# Altium project deepshark.PrjPcb
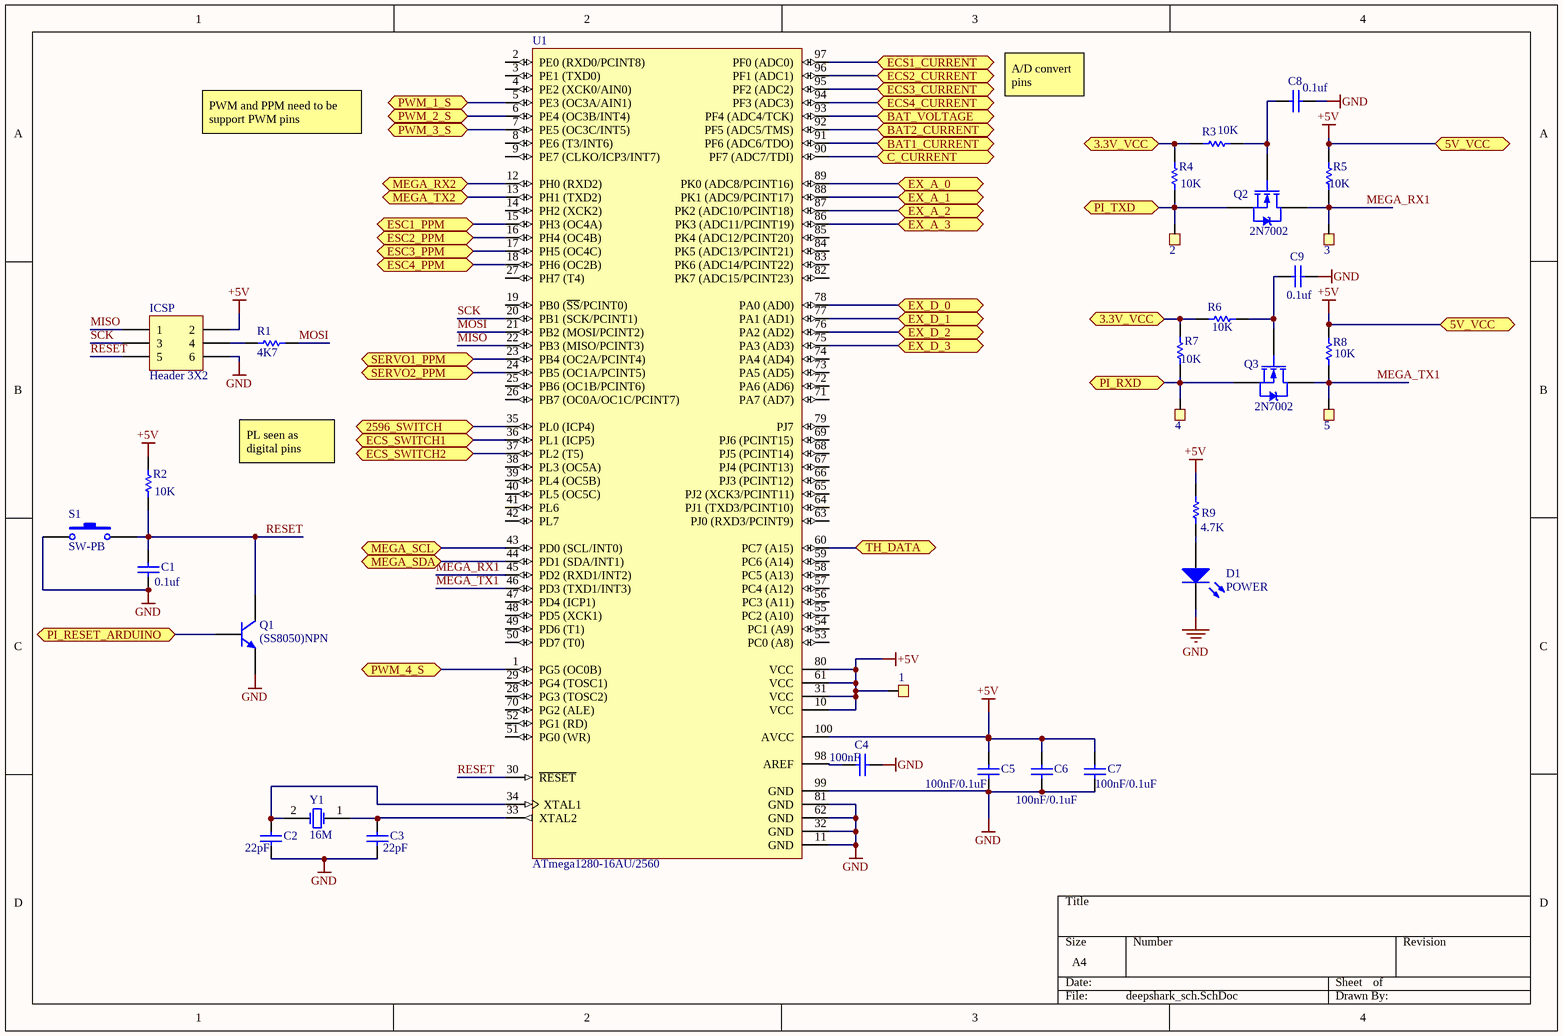
[diagram p0: deepshark_sch.SchDoc]
8 sheets, 211 parts. Net scope: flat (ports and power ports of the same name join across sheets).
Board file: deepshark_pcb.PcbDoc
Sheets:
  deepshark_sch.SchDoc
  deepshark_connector.SchDoc
  deepshark_power_sch.SchDoc
  deepshark_power_switch.SchDoc
  deepshark_pwm_power.SchDoc
  deepshark_sensor.SchDoc
  deepshark_ecs.SchDoc
  deepshark_servo.SchDoc

## Sheet deepshark_sch.SchDoc
size A4

### Parts
1  TP1  [TestPoint]  (value not drawn)
2  TP  [TestPoint]  (value not drawn)
3  TP  [TestPoint]  (value not drawn)
4  TP  [TestPoint]  (value not drawn)
5  TP  [TestPoint]  (value not drawn)
C1  value 0.1uf  [6-0805_M]  (hidden comment: Cap)
C2  value 22pF  [6-0805_M]  (hidden comment: Cap)
C3  value 22pF  [6-0805_M]  (hidden comment: Cap)
C4  value 100nF  [6-0805_M]  (hidden comment: Cap)
C5  value 100nF/0.1uF  [6-0805_M]  (hidden comment: Cap)
C6  value 100nF/0.1uF  [6-0805_M]  (hidden comment: Cap)
C7  value 100nF/0.1uF  [6-0805_M]  (hidden comment: Cap)
C8  value 0.1uf  [6-0805_M]  (hidden comment: Cap)
C9  value 0.1uf  [6-0805_M]  (hidden comment: Cap)
D1  POWER  [6-0805_M]
ICSP  Header 3X2  [HDR2X3]
Q1  (SS8050)NPN  [SOT89M]
Q2  2N7002  [2N7002]
Q3  2N7002  [2N7002]
R1  value 4K7  [6-0805_M]  (hidden comment: Res1)
R2  value 10K  [6-0805_M]  (hidden comment: Res1)
R3  value 10K  [6-0805_M]  (hidden comment: Res1)
R4  value 10K  [6-0805_M]  (hidden comment: Res1)
R5  value 10K  [6-0805_M]  (hidden comment: Res1)
R6  value 10K  [6-0805_M]  (hidden comment: Res1)
R7  value 10K  [6-0805_M]  (hidden comment: Res1)
R8  value 10K  [6-0805_M]  (hidden comment: Res1)
R9  value 4.7K  [6-0805_M]  (hidden comment: Res1)
S1  SW-PB  [switch4]
U1  ATmega1280-16AU/2560  [100A_N]
Y1  16M  [Y]

### Ports
3.3V_VCC, 5V_VCC, 2596_SWITCH, BAT1_CURRENT, BAT2_CURRENT, BAT_VOLTAGE, C_CURRENT, ECS1_CURRENT, ECS2_CURRENT, ECS3_CURRENT, ECS4_CURRENT, ECS_SWITCH1, ECS_SWITCH2, ESC1_PPM, ESC2_PPM, ESC3_PPM, ESC4_PPM, EX_A_0, EX_A_1, EX_A_2, EX_A_3, EX_D_0, EX_D_1, EX_D_2, EX_D_3, MEGA_RX2, MEGA_SCL, MEGA_SDA, MEGA_TX2, PI_RESET_ARDUINO, PI_RXD, PI_TXD, PWM_1_S, PWM_2_S, PWM_3_S, PWM_4_S, SERVO1_PPM, SERVO2_PPM, TH_DATA

### Nets
+5V: 1.1 C5.2 C6.2 C7.2 ICSP.2 R2.2 R5.2 R8.1 R9.1 U1.10(VCC) U1.31(VCC) U1.61(VCC) U1.80(VCC) U1.100(AVCC) ; port 5V_VCC
GND: C1.1 C2.2 C3.2 C4.1 C5.1 C6.1 C7.1 C8.2 C9.2 D1.2(K) ICSP.6 Q1.3(E) S1.1 U1.11(GND) U1.32(GND) U1.62(GND) U1.81(GND) U1.99(GND)
MEGA_RX1: 3.1 Q2.2(D) R5.1 U1.45(PD2_(RXD1/INT2))
MEGA_TX1: 5.1 Q3.2(D) R8.2 U1.46(PD3_(TXD1/INT3))
MISO: ICSP.1 U1.22(PB3_(MISO/PCINT3))
MOSI: R1.2 U1.21(PB2_(MOSI/PCINT2))
R_ONOFF: U1.35(PL0_(ICP4)) ; port 2596_SWITCH
RESET: C1.2 ICSP.5 Q1.1(C) R2.1 S1.2 U1.30(~{RESET})
SCK: ICSP.3 U1.20(PB1_(SCK/PCINT1))
Net2_1: 2.1 Q2.3(S) R4.2 ; port PI_TXD
Net4_1: 4.1 Q3.3(S) R7.1 ; port PI_RXD
Net9_1: R3.2 R4.1 R6.1 R7.2 ; port 3.3V_VCC
Net15_1: U1.93(PF4_(ADC4/TCK)) ; port BAT_VOLTAGE
Net20_1: U1.60(PC7_(A15)) ; port TH_DATA
Net22_1: U1.44(PD1_(SDA/INT1)) ; port MEGA_SDA
Net24_1: U1.43(PD0_(SCL/INT0)) ; port MEGA_SCL
NetC2_1: C2.1 U1.34(XTAL1) Y1.2(OSC2)
NetC3_1: C3.1 U1.33(XTAL2) Y1.1(OSC1)
NetC4_2: C4.2 U1.98(AREF)
NetC8_1: C8.1 Q2.1(G) R3.1
NetC9_1: C9.1 Q3.1(G) R6.2
NetD1_1: D1.1(A) R9.2
Netext_1: U1.89(PK0_(ADC8/PCINT16)) ; port EX_A_0
Netext_2: U1.78(PA0_(AD0)) ; port EX_D_0
Netext_3: U1.88(PK1_(ADC9/PCINT17)) ; port EX_A_1
Netext_4: U1.77(PA1_(AD1)) ; port EX_D_1
Netext_5: U1.87(PK2_(ADC10/PCINT18)) ; port EX_A_2
Netext_6: U1.76(PA2_(AD2)) ; port EX_D_2
Netext_7: U1.86(PK3_(ADC11/PCINT19)) ; port EX_A_3
Netext_8: U1.75(PA3_(AD3)) ; port EX_D_3
NetICSP_4: ICSP.4 R1.1
NetP16_3: U1.15(PH3_(OC4A)) ; port ESC1_PPM
NetP17_3: U1.16(PH4_(OC4B)) ; port ESC2_PPM
NetP18_3: U1.17(PH5_(OC4C)) ; port ESC3_PPM
NetP19_3: U1.18(PH6_(OC2B)) ; port ESC4_PPM
NetP35_1: U1.24(PB5_(OC1A/PCINT5)) ; port SERVO2_PPM
NetP36_1: U1.23(PB4_(OC2A/PCINT4)) ; port SERVO1_PPM
NetPI3_22: Q1.2(B) ; port PI_RESET_ARDUINO
NetR18_2: U1.91(PF6_(ADC6/TDO)) ; port BAT1_CURRENT
NetR22_2: U1.92(PF5_(ADC5/TMS)) ; port BAT2_CURRENT
NetR24_1: U1.36(PL1_(ICP5)) ; port ECS_SWITCH1
NetR26_2: U1.37(PL2_(T5)) ; port ECS_SWITCH2
NetR35_1: U1.90(PF7_(ADC7/TDI)) ; port C_CURRENT
NetR36_1: U1.5(PE3_(OC3A/AIN1)) ; port PWM_1_S
NetR38_1: U1.6(PE4_(OC3B/INT4)) ; port PWM_2_S
NetR40_1: U1.7(PE5_(OC3C/INT5)) ; port PWM_3_S
NetR42_1: U1.1(PG5_(OC0B)) ; port PWM_4_S
NetR55_2: U1.97(PF0_(ADC0)) ; port ECS1_CURRENT
NetR59_2: U1.96(PF1_(ADC1)) ; port ECS2_CURRENT
NetR63_2: U1.95(PF2_(ADC2)) ; port ECS3_CURRENT
NetR67_2: U1.94(PF3_(ADC3)) ; port ECS4_CURRENT
NetRX2_1: U1.13(PH1_(TXD2)) ; port MEGA_TX2
NetRX2_2: U1.12(PH0_(RXD2)) ; port MEGA_RX2

Not connected (* = marked no-connect by the designer): U1 2(PE0_(RXD0/PCINT8)) 3(PE1_(TXD0)) 4(PE2_(XCK0/AIN0)) 8(PE6_(T3/INT6)) 9(PE7_(CLKO/ICP3/INT7)) 14(PH2_(XCK2)) 19(PB0_(~{SS}/PCINT0)) 25(PB6_(OC1B/PCINT6)) 26(PB7_(OC0A/OC1C/PCINT7)) 27(PH7_(T4)) 28(PG3_(TOSC2)) 29(PG4_(TOSC1)) 38(PL3_(OC5A)) 39(PL4_(OC5B)) 40(PL5_(OC5C)) 41(PL6) 42(PL7) 47(PD4_(ICP1)) 48(PD5_(XCK1)) 49(PD6_(T1)) 50(PD7_(T0)) 51(PG0_(WR)) 52(PG1_(RD)) 53(PC0_(A8)) 54(PC1_(A9)) 55(PC2_(A10)) 56(PC3_(A11)) 57(PC4_(A12)) 58(PC5_(A13)) 59(PC6_(A14)) 63(PJ0_(RXD3/PCINT9)) 64(PJ1_(TXD3/PCINT10)) 65(PJ2_(XCK3/PCINT11)) 66(PJ3_(PCINT12)) 67(PJ4_(PCINT13)) 68(PJ5_(PCINT14)) 69(PJ6_(PCINT15)) 70(PG2_(ALE)) 71(PA7_(AD7)) 72(PA6_(AD6)) 73(PA5_(AD5)) 74(PA4_(AD4)) 79(PJ7) 82(PK7_(ADC15/PCINT23)) 83(PK6_(ADC14/PCINT22)) 84(PK5_(ADC13/PCINT21)) 85(PK4_(ADC12/PCINT20))

### Notes on the sheet
- A/D convert pins
- PWM and PPM need to be support PWM pins
- PL seen as digital pins

### Library data of the parts
1 = TP
C1-C9 = Cap: Capacitor; Published: 8-Jun-2000; LatestRevisionDate: 17-Jul-2002; LatestRevisionNote: Re-released for DXP Platform.; PackageReference: RAD-0.3; Publisher: Altium Limited; PackageDescription: Radial Cap, Thru-Hole; 2 Leads; 0.3 in Pin Spacing
D1 = LED0: Typical INFRARED GaAs LED; Published: 8-Jun-2000; LatestRevisionDate: 08-Jul-2005; LatestRevisionNote: Mech Layer 1 removed.; PackageReference: LED-0; Publisher: Altium Limited; PackageDescription: LED; 2 Leads
ICSP = Header 3X2: Header, 3-Pin, Dual row; LatestRevisionDate: 17-Jul-2002; LatestRevisionNote: Re-released for DXP Platform.; Publisher: Altium Limited
Q1 = NPN: NPN Bipolar Transistor; pin to pad: 1>2 2>1; Published: 8-Jun-2000; LatestRevisionDate: 17-Jul-2002; LatestRevisionNote: Re-released for DXP Platform.; PackageReference: TO-226-AA; Publisher: Altium Limited; PackageDescription: TO, Flat Index; 3 In-Line, Axial Leads; Body Dia. 4.8mm; Leads 0.55 x 0.51 mm (max); Code_JEDEC: TO-226-AA
Q2 Q3 = NMOS-2: N-Channel Power MOSFET; Note: Pin 2 is electrically connected to pin 4.; Published: 8-Jun-2000; LatestRevisionDate: 17-Jul-2002; LatestRevisionNote: Re-released for DXP Platform.; DatasheetVersion: PD-9.814; PackageVersion: Feb-1997; PackageReference: TO-220AB; Publisher: Altium Limited; PackageDescription: TO, Thru-Hole, Vertical, Heatsink Mounted; 3 In-Line Leads; Pitch 2.54 mm; ComponentLink1Description: Manufacturer Link; ComponentLink1URL: http://www.irf.com/
R1-R9 = Res1: Resistor; Published: 8-Jun-2000; LatestRevisionDate: 17-Jul-2002; LatestRevisionNote: Re-released for DXP Platform.; PackageReference: AXIAL-0.3; Publisher: Altium Limited; PackageDescription: Axial Device, Thru-Hole; 2 Leads; 0.3 in Pin Spacing
S1 = SW-PB: Switch; Published: 24-Mar-1999; LatestRevisionDate: 17-Jul-2002; LatestRevisionNote: Re-released for DXP Platform.; PackageReference: SPST-2; Publisher: Altium Limited; PackageDescription: Switch; 2 Leads
U1 = ATmega1280-16AU: 8-bit AVR Microcontroller, 2.7-5.5V, 8MHz, 128KB Flash, 4KB EEPROM, 8KB SRAM, 86 GPIO pins, 100-pin TQFP, Industrial Grade (-40癈 to 85癈), Pb-Free; DatasheetVersion: revN, May-2011; PackageVersion: revD, Oct-2010; PackageReference: 100A; PackageDescription: 100-Pin Thin Profile Plastic Quad Flat Pack (TQFP), 14 x 14 x 1.0 mm Body, 0.5 mm Pitch; Code_JEDEC: MS-026-AED; ComponentLink1Description: Manufacturer URL; ComponentLink1URL: http://www.atmel.com/; ComponentLink2Description: ATmega640/1280/1281/2560/2561 Datasheet; ComponentLink2URL: http://www.atmel.com/dyn/resources/prod_documents/doc2549.pdf; ComponentLink3Description: ATmega640/1280/1281/2560/2561 Summary; ComponentLink3URL: http://www.atmel.com/dyn/resources/prod_documents/2549S.pdf
Y1 = XTAL: Crystal Oscillator; Published: 8-Jun-2000; LatestRevisionDate: 17-Jul-2002; LatestRevisionNote: Re-released for DXP Platform.; PackageReference: R38; Publisher: Altium Limited; PackageDescription: Crystal, Thru-Hole; 2 Leads; Body 3.1 x 8.2 mm (Dia.xH)

## Sheet deepshark_connector.SchDoc
size A4
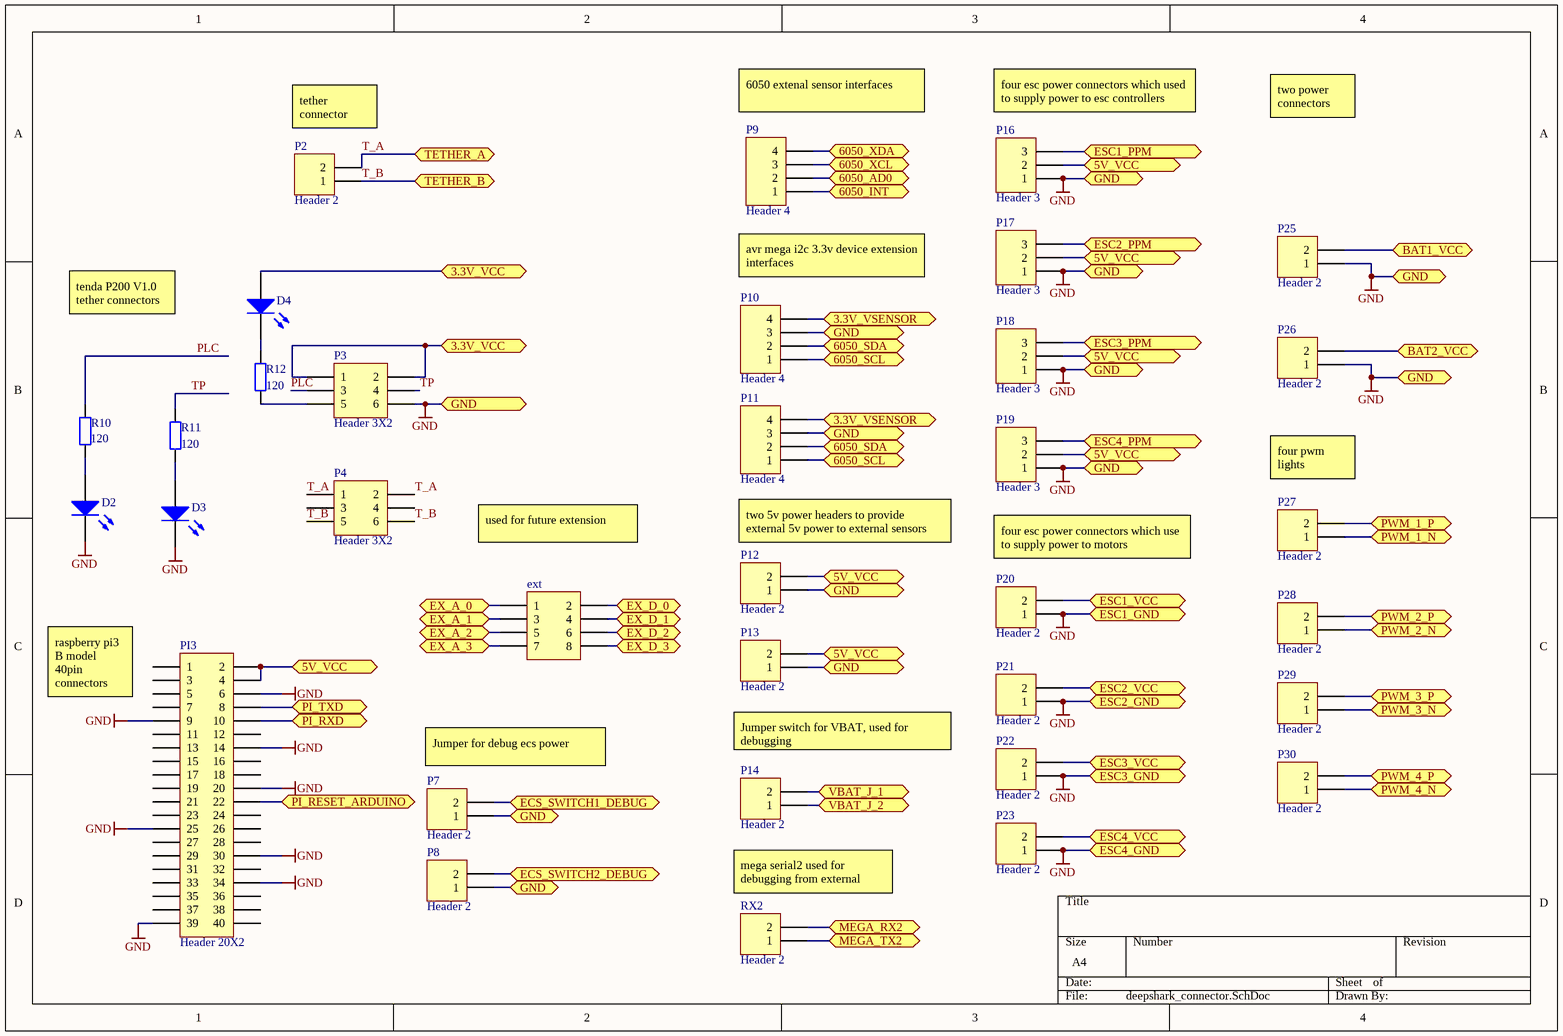
[diagram p1: deepshark_connector.SchDoc]

### Parts
D2  LED0  [6-0805_M]  (value not drawn)
D3  LED0  [6-0805_M]  (value not drawn)
D4  LED0  [6-0805_M]  (value not drawn)
ext  *  [HDR2X4]  (value not drawn)
P2  Header 2  [ConnectorBlue]
P3  Header 3X2  [HDR2X3]
P4  Header 3X2  [HDR2X3]
P7  Header 2  [HDR1X2]
P8  Header 2  [HDR1X2]
P9  Header 4  [HDR1X4]
P10  Header 4  [HDR1X4]
P11  Header 4  [HDR1X4]
P12  Header 2  [HDR1X2]
P13  Header 2  [HDR1X2]
P14  Header 2  [HDR1X2]
P16  Header 3  [HDR1X3]
P17  Header 3  [HDR1X3]
P18  Header 3  [HDR1X3]
P19  Header 3  [HDR1X3]
P20  Header 2  [ConnectorBlue]
P21  Header 2  [ConnectorBlue]
P22  Header 2  [ConnectorBlue]
P23  Header 2  [ConnectorBlue]
P25  Header 2  [ConnectorBlue]
P26  Header 2  [ConnectorBlue]
P27  Header 2  [headerX2]
P28  Header 2  [headerX2]
P29  Header 2  [headerX2]
P30  Header 2  [headerX2]
PI3  Header 20X2  [HDR2X20]
R10  value 120  [6-0805_M]  (hidden comment: Res2)
R11  value 120  [6-0805_M]  (hidden comment: Res2)
R12  value 120  [6-0805_M]  (hidden comment: Res2)
RX2  Header 2  [HDR1X2]

### Ports
3.3V_VCC, 3.3V_VSENSOR, 5V_VCC, 6050_AD0, 6050_INT, 6050_SCL, 6050_SDA, 6050_XCL, 6050_XDA, BAT1_VCC, BAT2_VCC, ECS_SWITCH1_DEBUG, ECS_SWITCH2_DEBUG, ESC1_GND, ESC1_PPM, ESC1_VCC, ESC2_GND, ESC2_PPM, ESC2_VCC, ESC3_GND, ESC3_PPM, ESC3_VCC, ESC4_GND, ESC4_PPM, ESC4_VCC, EX_A_0, EX_A_1, EX_A_2, EX_A_3, EX_D_0, EX_D_1, EX_D_2, EX_D_3, GND, MEGA_RX2, MEGA_TX2, PI_RESET_ARDUINO, PI_RXD, PI_TXD, PWM_1_N, PWM_1_P, PWM_2_N, PWM_2_P, PWM_3_N, PWM_3_P, PWM_4_N, PWM_4_P, TETHER_A (bidir), TETHER_B (bidir), VBAT_J_1, VBAT_J_2

### Nets
+5V: P12.2 P13.2 P16.2 P17.2 P18.2 P19.2 PI3.2 PI3.4 ; port 5V_VCC
BAT1: P25.2 ; port BAT1_VCC
BAT2: P26.2 ; port BAT2_VCC
GND: D2.2(K) D3.2(K) P3.6 P7.1 P8.1 P10.3 P11.3 P12.1 P13.1 P14.1 P16.1 P17.1 P18.1 P19.1 P20.1 P21.1 P22.1 P23.1 P25.1 P26.1 PI3.6 PI3.9 PI3.14 PI3.20 PI3.25 PI3.30 PI3.34 PI3.39 ; port GND, port ESC1_GND, port ESC2_GND, port ESC3_GND, port ESC4_GND, port VBAT_J_2
PLC: P3.3 R10.2
T_A: P2.2 P4.1 P4.2 ; port TETHER_A
T_B: P2.1 P4.5 P4.6 ; port TETHER_B
TP: P3.4 R11.2
Net2_1: PI3.8 ; port PI_TXD
Net4_1: PI3.10 ; port PI_RXD
Net9_1: D4.1(A) P3.1 P3.2 ; port 3.3V_VCC
Net10_1: P10.4 P11.4 ; port 3.3V_VSENSOR
Net13_1: P7.2 ; port ECS_SWITCH1_DEBUG
Net14_1: P8.2 ; port ECS_SWITCH2_DEBUG
Net16_1: P27.1 ; port PWM_1_N
Net17_1: P29.1 ; port PWM_3_N
Net18_1: P28.1 ; port PWM_2_N
Net19_1: P30.1 ; port PWM_4_N
Net21_1: P10.2 P11.2 ; port 6050_SDA
Net23_1: P10.1 P11.1 ; port 6050_SCL
Net25_1: P20.2 ; port ESC1_VCC
Net26_1: P21.2 ; port ESC2_VCC
Net27_1: P22.2 ; port ESC3_VCC
Net28_1: P23.2 ; port ESC4_VCC
NetC20_1: P27.2 P28.2 P29.2 P30.2 ; port PWM_1_P, port PWM_2_P, port PWM_3_P, port PWM_4_P
NetD2_1: D2.1(A) R10.1
NetD3_1: D3.1(A) R11.1
NetD4_2: D4.2(K) R12.2
Netext_1: ext.1 ; port EX_A_0
Netext_2: ext.2 ; port EX_D_0
Netext_3: ext.3 ; port EX_A_1
Netext_4: ext.4 ; port EX_D_1
Netext_5: ext.5 ; port EX_A_2
Netext_6: ext.6 ; port EX_D_2
Netext_7: ext.7 ; port EX_A_3
Netext_8: ext.8 ; port EX_D_3
NetP3_5: P3.5 R12.1
NetP9_1: P9.1 ; port 6050_INT
NetP9_2: P9.2 ; port 6050_AD0
NetP9_3: P9.3 ; port 6050_XCL
NetP9_4: P9.4 ; port 6050_XDA
NetP14_2: P14.2 ; port VBAT_J_1
NetP16_3: P16.3 ; port ESC1_PPM
NetP17_3: P17.3 ; port ESC2_PPM
NetP18_3: P18.3 ; port ESC3_PPM
NetP19_3: P19.3 ; port ESC4_PPM
NetPI3_22: PI3.22 ; port PI_RESET_ARDUINO
NetRX2_1: RX2.1 ; port MEGA_TX2
NetRX2_2: RX2.2 ; port MEGA_RX2

Not connected (* = marked no-connect by the designer): P4 3 4; PI3 1 3 5 7 11 12 13 15 16 17 18 19 21 23 24 26 27 28 29 31 32 33 35 36 37 38 40

### Notes on the sheet
- (near P9) 6050 extenal sensor interfaces
- (near P16) four esc power connectors which used to supply power to esc controllers
- two power connectors
- (near P2) tether connector
- tenda P200 V1.0 tether connectors
- avr mega i2c 3.3v device extension interfaces
- (near P27) four pwm lights connectors
- used for future extension
- two 5v power headers to provide external 5v power to external sensors
- four esc power connectors which use to supply power to motors
- (near PI3) raspberry pi3 B model 40pin connectors
- (near P7) Jumper for debug ecs power
- Jumper switch for VBAT, used for debugging
- mega serial2 used for debugging from external

### Library data of the parts
D2-D4 = LED0: Typical INFRARED GaAs LED; Published: 8-Jun-2000; LatestRevisionDate: 08-Jul-2005; LatestRevisionNote: Mech Layer 1 removed.; PackageReference: LED-0; Publisher: Altium Limited; PackageDescription: LED; 2 Leads
ext = Header 4X2: Header, 4-Pin, Dual row; LatestRevisionDate: 17-Jul-2002; LatestRevisionNote: Re-released for DXP Platform.; Publisher: Altium Limited
P2 P7 P8 P12-P14 P20-P23 P25-P30 RX2 = Header 2: Header, 2-Pin; LatestRevisionDate: 17-Jul-2002; LatestRevisionNote: Re-released for DXP Platform.; Publisher: Altium Limited
P3 P4 = Header 3X2: Header, 3-Pin, Dual row; LatestRevisionDate: 17-Jul-2002; LatestRevisionNote: Re-released for DXP Platform.; Publisher: Altium Limited
P9-P11 = Header 4: Header, 4-Pin; LatestRevisionDate: 17-Jul-2002; LatestRevisionNote: Re-released for DXP Platform.; Publisher: Altium Limited
P16-P19 = Header 3: Header, 3-Pin; LatestRevisionDate: 17-Jul-2002; LatestRevisionNote: Re-released for DXP Platform.; Publisher: Altium Limited
PI3 = Header 20X2: Header, 20-Pin, Dual row; LatestRevisionDate: 17-Jul-2002; LatestRevisionNote: Re-released for DXP Platform.; Publisher: Altium Limited
R10-R12 = Res2: Resistor; Published: 8-Jun-2000; LatestRevisionDate: 17-Jul-2002; LatestRevisionNote: Re-released for DXP Platform.; PackageReference: AXIAL-0.4; Publisher: Altium Limited; PackageDescription: Axial Device, Thru-Hole; 2 Leads; 0.4 in Pin Spacing

## Sheet deepshark_power_sch.SchDoc
size A4
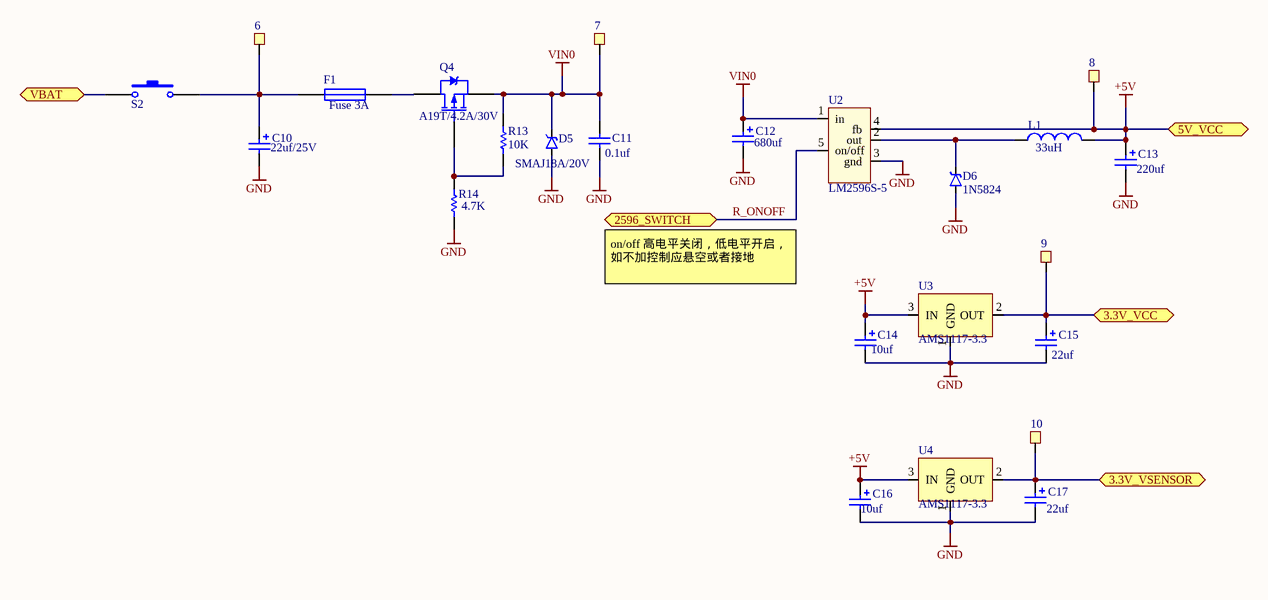
[diagram p2: deepshark_power_sch.SchDoc]

### Parts
6  TP  [TestPoint]  (value not drawn)
7  TP  [TestPoint]  (value not drawn)
8  TP  [TestPoint]  (value not drawn)
9  TP  [TestPoint]  (value not drawn)
10  TP  [TestPoint]  (value not drawn)
C10  value 22uf/25V  [22uf-25V]  (hidden comment: Cap Pol2)
C11  value 0.1uf  [6-0805_M]  (hidden comment: Cap)
C12  value 680uf  [680uf-50v]  (hidden comment: Cap Pol2)
C13  value 220uf  [220uf-50v]  (hidden comment: Cap Pol2)
C14  value 10uf  [1206]  (hidden comment: Cap Pol2)
C15  value 22uf  [my0603]  (hidden comment: Cap Pol2)
C16  value 10uf  [1206]  (hidden comment: Cap Pol2)
C17  value 22uf  [my0603]  (hidden comment: Cap Pol2)
D5  SMAJ18A/20V  [SMBJ6.5A]
D6  1N5824  [1N5824]
F1  Fuse 3A  [1206]
L1  value 33uH  [12x12 L]  (hidden comment: Inductor)
Q4  A19T/4.2A/30V  [A19T]
R13  value 10K  [6-0805_M]  (hidden comment: Res1)
R14  value 4.7K  [6-0805_M]  (hidden comment: Res1)
S2  SW-PB  [switch-2bit]  (value not drawn)
U2  LM2596S-5  [LM2596]
U3  AMS1117-3.3  [SOT223_M]
U4  AMS1117-3.3  [SOT223_M]

### Ports
3.3V_VCC, 3.3V_VSENSOR, 5V_VCC, 2596_SWITCH, VBAT

### Nets
+5V: 8.1 C13.1 C14.1 C16.1 L1.2 U2.4(fb) U3.3(IN) U4.3(IN) ; port 5V_VCC
GND: C10.2 C11.1 C12.2 C13.2 C14.2 C15.2 C16.2 C17.2 D5.A D6.A R14.1 U2.3(gnd) U3.1(GND) U4.1(GND)
VIN0: 7.1 C11.2 C12.1 D5.K Q4.3(S) R13.1 U2.1(in)
R_ONOFF: U2.5(on/off) ; port 2596_SWITCH
Net6_1: 6.1 C10.1 F1.1 S2.1
Net9_1: 9.1 C15.1 U3.2(OUT) ; port 3.3V_VCC
Net10_1: 10.1 C17.1 U4.2(OUT) ; port 3.3V_VSENSOR
NetD6_K: D6.K L1.1 U2.2(out)
NetF1_2: F1.2 Q4.2(D)
NetQ4_1: Q4.1(G) R13.2 R14.2
NetR32_1: S2.2 ; port VBAT

### Notes on the sheet
- on/off 高电平关闭，低电平开启，如不加控制应悬空或者接地

### Library data of the parts
C10 C12-C17 = Cap Pol2: Polarized Capacitor (Axial); Published: 8-Jun-2000; LatestRevisionDate: 17-Jul-2002; LatestRevisionNote: Re-released for DXP Platform.; PackageReference: POLAR0.8; Publisher: Altium Limited; PackageDescription: Polarized Capacitor; 2 Leads
C11 = Cap: Capacitor; Published: 8-Jun-2000; LatestRevisionDate: 17-Jul-2002; LatestRevisionNote: Re-released for DXP Platform.; PackageReference: RAD-0.3; Publisher: Altium Limited; PackageDescription: Radial Cap, Thru-Hole; 2 Leads; 0.3 in Pin Spacing
D5 D6 = DW
F1 = Fuse 1: Fuse; Published: 8-Jun-2000; LatestRevisionDate: 17-Jul-2002; LatestRevisionNote: Re-released for DXP Platform.; PackageReference: PIN-W2/E2.8; Publisher: Altium Limited; PackageDescription: Thru-Hole; 2 Leads
L1 = Inductor: Code_IEC: 1005; Published: 8-Jun-2000; LatestRevisionDate: 29-May-2009; LatestRevisionNote: IPC-7351 Footprint Added.; PackageReference: 0402-A; Publisher: Altium Limited; PackageDescription: Chip Inductor; Code_JEITA: 0402
Q4 = PMOS-2: P-Channel Power MOSFET; Note: Pin 4 not drawn and electrically connected to Pin 2.; Published: 8-Jun-2000; LatestRevisionDate: 17-Jul-2002; LatestRevisionNote: Re-released for DXP Platform.; DatasheetVersion: PD-9.390D; PackageVersion: Feb-1997; PackageReference: TO-220AB; Publisher: Altium Limited; PackageDescription: TO, Thru-Hole, Vertical, Heatsink Mounted; 3 In-Line Leads; Pitch 2.54 mm; ComponentLink1Description: Manufacturer Link; ComponentLink1URL: http://www.irf.com/
R13 R14 = Res1: Resistor; Published: 8-Jun-2000; LatestRevisionDate: 17-Jul-2002; LatestRevisionNote: Re-released for DXP Platform.; PackageReference: AXIAL-0.3; Publisher: Altium Limited; PackageDescription: Axial Device, Thru-Hole; 2 Leads; 0.3 in Pin Spacing
S2 = SW-PB: Switch; Published: 24-Mar-1999; LatestRevisionDate: 17-Jul-2002; LatestRevisionNote: Re-released for DXP Platform.; PackageReference: SPST-2; Publisher: Altium Limited; PackageDescription: Switch; 2 Leads

## Sheet deepshark_power_switch.SchDoc
size A4
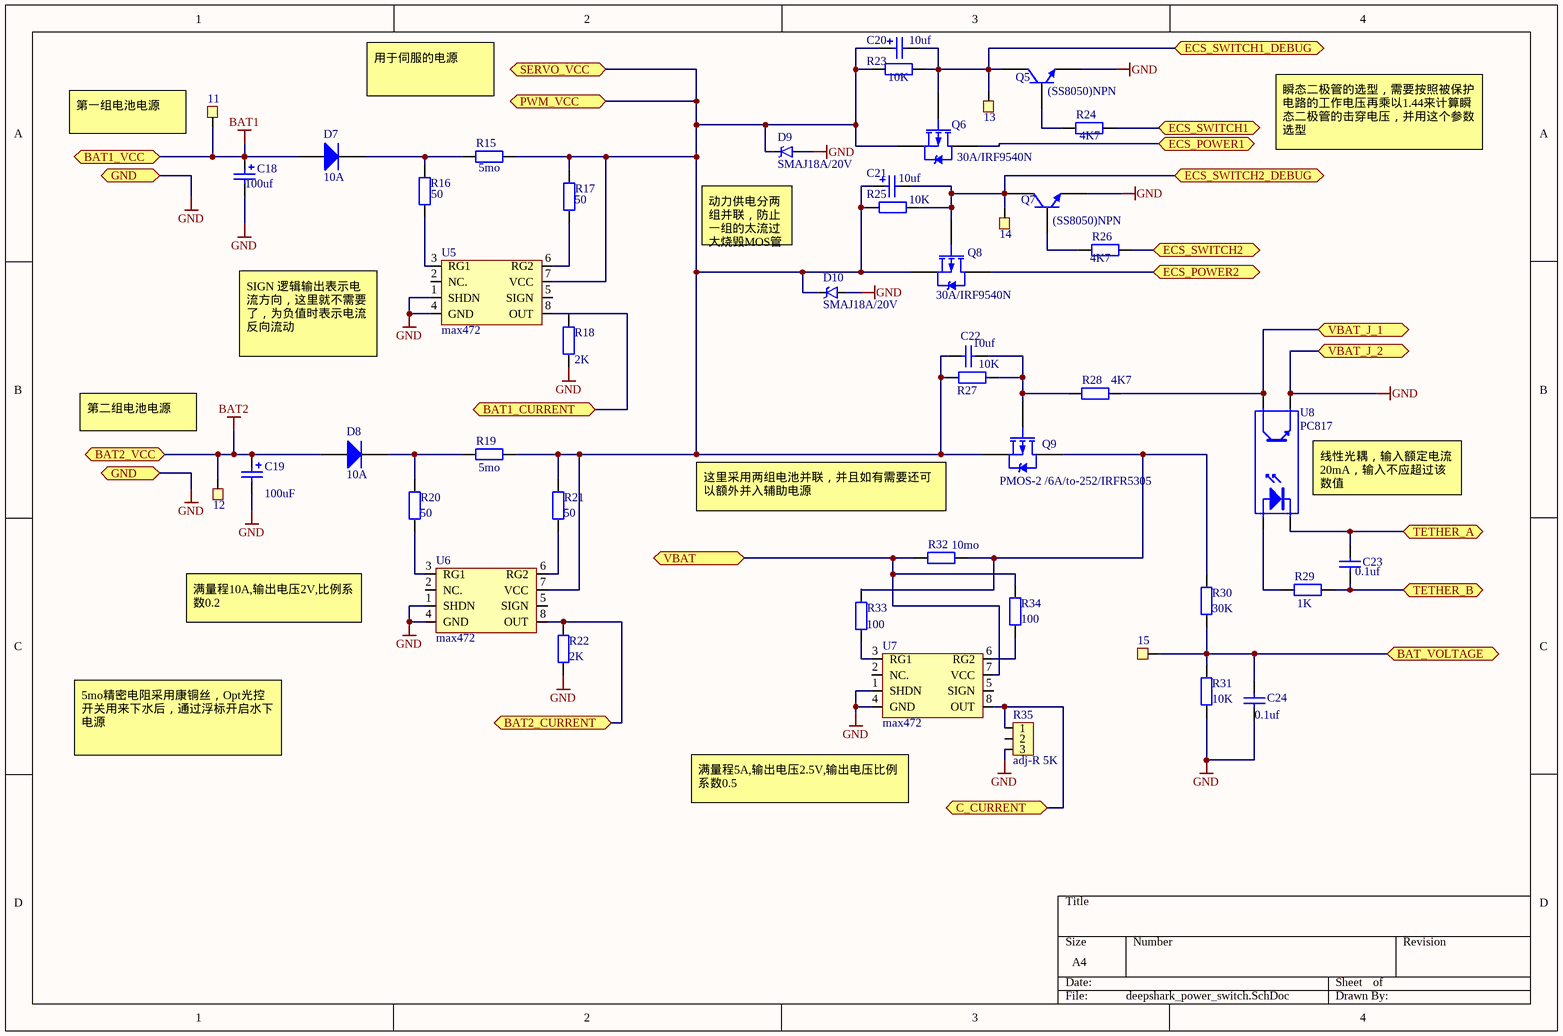
[diagram p3: deepshark_power_switch.SchDoc]

### Parts
11  TP  [TestPoint]  (value not drawn)
12  TP  [TestPoint]  (value not drawn)
13  TP  [TestPoint]  (value not drawn)
14  TP  [TestPoint]  (value not drawn)
15  TP  [TestPoint]  (value not drawn)
C18  value 100uf  [100uf-25v]  (hidden comment: Cap Pol2)
C19  value 100uF  [100uf-25v]  (hidden comment: Cap Pol2)
C20  value 10uf  [1206]  (hidden comment: Cap Pol2)
C21  value 10uf  [1206]  (hidden comment: Cap Pol2)
C22  value 10uf  [1206]  (hidden comment: Cap)
C23  value 0.1uf  [6-0805_M]  (hidden comment: Cap)
C24  value 0.1uf  [6-0805_M]  (hidden comment: Cap)
D7  10A  [10A-Rectifier]
D8  10A  [10A-Rectifier]
D9  SMAJ18A/20V  [SMBJ6.5A]
D10  SMAJ18A/20V  [SMBJ6.5A]
Q5  (SS8050)NPN  [SOT89M]
Q6  30A/IRF9540N  [my-TO-220AB]
Q7  (SS8050)NPN  [SOT89M]
Q8  30A/IRF9540N  [my-TO-220AB]
Q9  PMOS-2 /6A/to-252/IRFR5305  [TO-252AA]
R15  value 5mo  [5mo]  (hidden comment: Res2)
R16  value 50  [my0603]  (hidden comment: Res2)
R17  value 50  [my0603]  (hidden comment: Res2)
R18  value 2K  [6-0805_M]  (hidden comment: Res2)
R19  value 5mo  [5mo]  (hidden comment: Res2)
R20  value 50  [my0603]  (hidden comment: Res2)
R21  value 50  [my0603]  (hidden comment: Res2)
R22  value 2K  [6-0805_M]  (hidden comment: Res2)
R23  value 10K  [6-0805_M]  (hidden comment: Res2)
R24  value 4K7  [6-0805_M]  (hidden comment: Res2)
R25  value 10K  [6-0805_M]  (hidden comment: Res2)
R26  value 4K7  [6-0805_M]  (hidden comment: Res2)
R27  value 10K  [6-0805_M]  (hidden comment: Res2)
R28  value 4K7  [6-0805_M]  (hidden comment: Res2)
R29  value 1K  [6-0805_M]  (hidden comment: Res2)
R30  value 30K  [6-0805_M]  (hidden comment: Res2)
R31  value 10K  [6-0805_M]  (hidden comment: Res2)
R32  value 10mo  [10mo]  (hidden comment: Res2)
R33  value 100  [my0603]  (hidden comment: Res2)
R34  value 100  [my0603]  (hidden comment: Res2)
R35  adj-R 5K  [adj-R]
U5  max472  [SO-8_M]
U6  max472  [SO-8_M]
U7  max472  [SO-8_M]
U8  PC817  [DIP-4]

### Ports
BAT1_CURRENT, BAT1_VCC, BAT2_CURRENT, BAT2_VCC, BAT_VOLTAGE, C_CURRENT, ECS_POWER1, ECS_POWER2, ECS_SWITCH1, ECS_SWITCH1_DEBUG, ECS_SWITCH2, ECS_SWITCH2_DEBUG, GND, PWM_VCC, SERVO_VCC, TETHER_A (bidir), TETHER_B (bidir), VBAT, VBAT_J_1, VBAT_J_2

### Nets
BAT1: 11.1 C18.1 D7.1(A) ; port BAT1_VCC
BAT2: 12.1 C19.1 D8.1(A) ; port BAT2_VCC
GND: C18.2 C19.2 C24.1 D9.A D10.A Q5.3(E) Q7.3(E) R18.1 R22.1 R31.1 R35.3 U5.1(SHDN) U5.4(GND) U6.1(SHDN) U6.4(GND) U7.1(SHDN) U7.4(GND) U8.3(E) ; port GND, port VBAT_J_2
T_A: C23.2 U8.2(K) ; port TETHER_A
T_B: C23.1 R29.2 ; port TETHER_B
Net13_1: 13.1 C20.2 Q5.1(C) Q6.1(G) R23.2 ; port ECS_SWITCH1_DEBUG
Net14_1: 14.1 C21.2 Q7.1(C) Q8.1(G) R25.2 ; port ECS_SWITCH2_DEBUG
Net15_1: 15.1 C24.2 R30.1 R31.2 ; port BAT_VOLTAGE
NetC20_1: C20.1 C21.1 C22.1 D9.K D10.K Q6.3(S) Q8.3(S) Q9.3(S) R15.2 R17.2 R19.2 R21.2 R23.1 R25.1 R27.1 U5.7(VCC) U6.7(VCC) ; port SERVO_VCC, port PWM_VCC
NetC22_2: C22.2 Q9.1(G) R27.2 R28.1
NetD7_2: D7.2(K) R15.1 R16.2
NetD8_2: D8.2(K) R19.1 R20.2
NetP14_2: R28.2 U8.4(C) ; port VBAT_J_1
NetQ5_2: Q5.2(B) R24.2
NetQ6_2: Q6.2(D) ; port ECS_POWER1
NetQ7_2: Q7.2(B) R26.1
NetQ8_2: Q8.2(D) ; port ECS_POWER2
NetQ9_4: Q9.4(D) R30.2 R32.2 R33.2
NetR16_1: R16.1 U5.3(RG1)
NetR17_1: R17.1 U5.6(RG2)
NetR18_2: R18.2 U5.8(OUT) ; port BAT1_CURRENT
NetR20_1: R20.1 U6.3(RG1)
NetR21_1: R21.1 U6.6(RG2)
NetR22_2: R22.2 U6.8(OUT) ; port BAT2_CURRENT
NetR24_1: R24.1 ; port ECS_SWITCH1
NetR26_2: R26.2 ; port ECS_SWITCH2
NetR29_1: R29.1 U8.1(A)
NetR32_1: R32.1 R34.2 U7.7(VCC) ; port VBAT
NetR33_1: R33.1 U7.3(RG1)
NetR34_1: R34.1 U7.6(RG2)
NetR35_1: R35.1 U7.8(OUT) ; port C_CURRENT

Not connected (* = marked no-connect by the designer): R35 2; U5 2(NC.) 5(SIGN); U6 2(NC.) 5(SIGN); U7 2(NC.) 5(SIGN)

### Notes on the sheet
- 用于伺服的电源
- (near 11) 第一组电池电源
- 瞬态二极管的选型，需要按照被保护电路的工作电压再乘以1.44来计算瞬态二极管的击穿电压，并用这个参数选型
- (near D9) 动力供电分两组并联，防止一组的太流过大烧毁MOS管
- SIGN 逻辑输出表示电流方向，这里就不需要了，为负值时表示电流反向流动
- 第二组电池电源
- 这里采用两组电池并联，并且如有需要还可以额外并入辅助电源
- (near U8) 线性光耦，输入额定电流20mA，输入不应超过该数值
- 满量程10A,输出电压2V,比例系数0.2
- 5mo精密电阻采用康铜丝，Opt光控开关用来下水后，通过浮标开启水下电源
- (near U7) 满量程5A,输出电压2.5V,输出电压比例系数0.5

### Library data of the parts
C18-C21 = Cap Pol2: Polarized Capacitor (Axial); Published: 8-Jun-2000; LatestRevisionDate: 17-Jul-2002; LatestRevisionNote: Re-released for DXP Platform.; PackageReference: POLAR0.8; Publisher: Altium Limited; PackageDescription: Polarized Capacitor; 2 Leads
C22-C24 = Cap: Capacitor; Published: 8-Jun-2000; LatestRevisionDate: 17-Jul-2002; LatestRevisionNote: Re-released for DXP Platform.; PackageReference: RAD-0.3; Publisher: Altium Limited; PackageDescription: Radial Cap, Thru-Hole; 2 Leads; 0.3 in Pin Spacing
D7 D8 = Diode: Default Diode; Published: 8-Jun-2000; LatestRevisionDate: 17-Jul-2002; LatestRevisionNote: Re-released for DXP Platform.; PackageVersion: Sep-1996; PackageReference: SMC; Publisher: Altium Limited; PackageDescription: DO-214-AB/SMC; 2 C-Bend Leads; Body 7.9 x 5.9 mm, inc. leads (LxW); Code_JEDEC: DO-214-AB
D9 D10 = DW
Q5 Q7 = NPN: NPN Bipolar Transistor; pin to pad: 1>2 2>1; Published: 8-Jun-2000; LatestRevisionDate: 17-Jul-2002; LatestRevisionNote: Re-released for DXP Platform.; PackageReference: TO-226-AA; Publisher: Altium Limited; PackageDescription: TO, Flat Index; 3 In-Line, Axial Leads; Body Dia. 4.8mm; Leads 0.55 x 0.51 mm (max); Code_JEDEC: TO-226-AA
Q6 Q8 Q9 = PMOS-2: as Q4 on sheet deepshark_power_sch; Published: 8-Jun-2000; LatestRevisionDate: 17-Jul-2002; LatestRevisionNote: Re-released for DXP Platform.; DatasheetVersion: PD-9.390D; PackageVersion: Feb-1997; PackageReference: TO-220AB; Publisher: Altium Limited; PackageDescription: TO, Thru-Hole, Vertical, Heatsink Mounted; 3 In-Line Leads; Pitch 2.54 mm; ComponentLink1Description: Manufacturer Link; ComponentLink1URL: http://www.irf.com/
R15-R34 = Res2: Resistor; Published: 8-Jun-2000; LatestRevisionDate: 17-Jul-2002; LatestRevisionNote: Re-released for DXP Platform.; PackageReference: AXIAL-0.4; Publisher: Altium Limited; PackageDescription: Axial Device, Thru-Hole; 2 Leads; 0.4 in Pin Spacing
R35 = adj-R
U8 = Optoisolator1: 4-Pin Phototransistor Optocoupler; Published: 24-Mar-1999; LatestRevisionDate: 04-Mar-2005; LatestRevisionNote: Sch pins 3 & 4 Swapped.; DatasheetVersion: Nov-2003; PackageReference: DIP-4; Publisher: Altium Limited

## Sheet deepshark_pwm_power.SchDoc
size A4
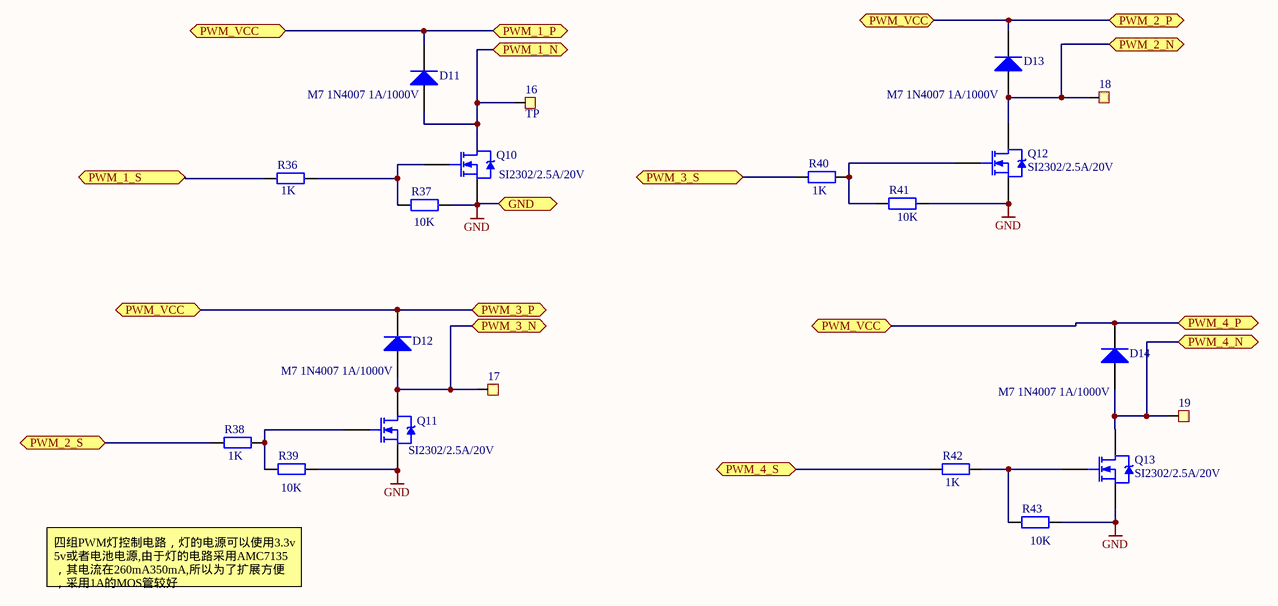
[diagram p4: deepshark_pwm_power.SchDoc]

### Parts
16  TP  [TestPoint]
17  TP  [TestPoint]  (value not drawn)
18  TP  [TestPoint]  (value not drawn)
19  TP  [TestPoint]  (value not drawn)
D11  M7 1N4007 1A/1000V  [M7-1n4007]
D12  M7 1N4007 1A/1000V  [M7-1n4007]
D13  M7 1N4007 1A/1000V  [M7-1n4007]
D14  M7 1N4007 1A/1000V  [M7-1n4007]
Q10  SI2302/2.5A/20V  [SOT23_M]
Q11  SI2302/2.5A/20V  [SOT23_M]
Q12  SI2302/2.5A/20V  [SOT23_M]
Q13  SI2302/2.5A/20V  [SOT23_M]
R36  value 1K  [6-0805_M]  (hidden comment: Res2)
R37  value 10K  [6-0805_M]  (hidden comment: Res2)
R38  value 1K  [6-0805_M]  (hidden comment: Res2)
R39  value 10K  [6-0805_M]  (hidden comment: Res2)
R40  value 1K  [6-0805_M]  (hidden comment: Res2)
R41  value 10K  [6-0805_M]  (hidden comment: Res2)
R42  value 1K  [6-0805_M]  (hidden comment: Res2)
R43  value 10K  [6-0805_M]  (hidden comment: Res2)

### Ports
GND, PWM_1_N, PWM_1_P, PWM_1_S, PWM_2_N, PWM_2_P, PWM_2_S, PWM_3_N, PWM_3_P, PWM_3_S, PWM_4_N, PWM_4_P, PWM_4_S, PWM_VCC

### Nets
GND: Q10.3(S) Q11.3(S) Q12.3(S) Q13.3(S) R37.2 R39.2 R41.2 R43.2 ; port GND
Net16_1: 16.1 D11.1(A) Q10.2(D) ; port PWM_1_N
Net17_1: 17.1 D12.1(A) Q11.2(D) ; port PWM_3_N
Net18_1: 18.1 D13.1(A) Q12.2(D) ; port PWM_2_N
Net19_1: 19.1 D14.1(A) Q13.2(D) ; port PWM_4_N
NetC20_1: D11.2(K) D12.2(K) D13.2(K) D14.2(K) ; port PWM_VCC, port PWM_1_P, port PWM_2_P, port PWM_3_P, port PWM_4_P
NetQ10_1: Q10.1(G) R36.2 R37.1
NetQ11_1: Q11.1(G) R38.2 R39.1
NetQ12_1: Q12.1(G) R40.2 R41.1
NetQ13_1: Q13.1(G) R42.2 R43.1
NetR36_1: R36.1 ; port PWM_1_S
NetR38_1: R38.1 ; port PWM_2_S
NetR40_1: R40.1 ; port PWM_3_S
NetR42_1: R42.1 ; port PWM_4_S

### Notes on the sheet
- 四组PWM灯控制电路，灯的电源可以使用3.3v 5v或者电池电源,由于灯的电路采用AMC7135，其电流在260mA350mA,所以为了扩展方便，采用1A的MOS管较好

### Library data of the parts
D11-D14 = Diode: Default Diode; Published: 8-Jun-2000; LatestRevisionDate: 17-Jul-2002; LatestRevisionNote: Re-released for DXP Platform.; PackageVersion: Sep-1996; PackageReference: SMC; Publisher: Altium Limited; PackageDescription: DO-214-AB/SMC; 2 C-Bend Leads; Body 7.9 x 5.9 mm, inc. leads (LxW); Code_JEDEC: DO-214-AB
Q10-Q13 = NMOS-2: N-Channel Power MOSFET; pin to pad: 1>3 2>1 3>2; Note: Pin 2 is electrically connected to pin 4.; Published: 8-Jun-2000; LatestRevisionDate: 17-Jul-2002; LatestRevisionNote: Re-released for DXP Platform.; DatasheetVersion: PD-9.814; PackageVersion: Feb-1997; PackageReference: TO-220AB; Publisher: Altium Limited; PackageDescription: TO, Thru-Hole, Vertical, Heatsink Mounted; 3 In-Line Leads; Pitch 2.54 mm; ComponentLink1Description: Manufacturer Link; ComponentLink1URL: http://www.irf.com/
R36-R43 = Res2: Resistor; Published: 8-Jun-2000; LatestRevisionDate: 17-Jul-2002; LatestRevisionNote: Re-released for DXP Platform.; PackageReference: AXIAL-0.4; Publisher: Altium Limited; PackageDescription: Axial Device, Thru-Hole; 2 Leads; 0.4 in Pin Spacing

## Sheet deepshark_sensor.SchDoc
size A4
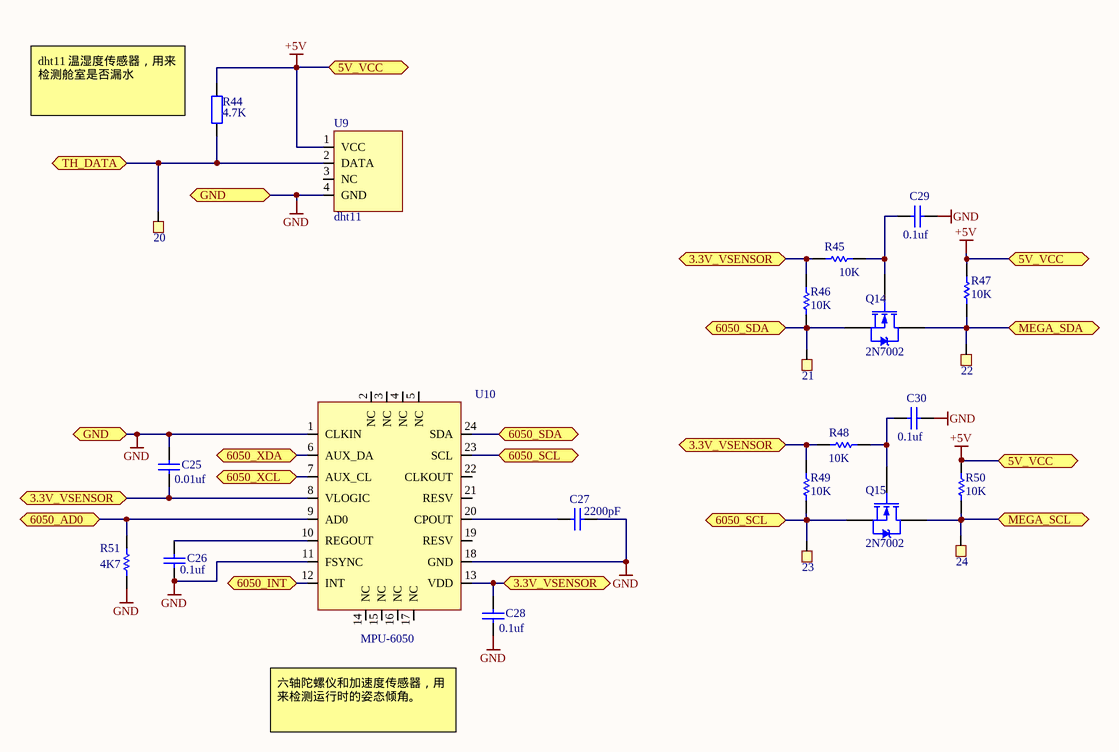
[diagram p5: deepshark_sensor.SchDoc]

### Parts
20  TP  [TestPoint]  (value not drawn)
21  TP  [TestPoint]  (value not drawn)
22  TP  [TestPoint]  (value not drawn)
23  TP  [TestPoint]  (value not drawn)
24  TP  [TestPoint]  (value not drawn)
C25  value 0.01uf  [6-0805_M]  (hidden comment: Cap)
C26  value 0.1uf  [6-0805_M]  (hidden comment: Cap)
C27  value 2200pF  [my0603]  (hidden comment: Cap)
C28  value 0.1uf  [6-0805_M]  (hidden comment: Cap)
C29  value 0.1uf  [6-0805_M]  (hidden comment: Cap)
C30  value 0.1uf  [6-0805_M]  (hidden comment: Cap)
Q14  2N7002  [2N7002]
Q15  2N7002  [2N7002]
R44  value 4.7K  [6-0805_M]  (hidden comment: Res2)
R45  value 10K  [6-0805_M]  (hidden comment: Res1)
R46  value 10K  [6-0805_M]  (hidden comment: Res1)
R47  value 10K  [6-0805_M]  (hidden comment: Res1)
R48  value 10K  [6-0805_M]  (hidden comment: Res1)
R49  value 10K  [6-0805_M]  (hidden comment: Res1)
R50  value 10K  [6-0805_M]  (hidden comment: Res1)
R51  value 4K7  [6-0805_M]  (hidden comment: Res1)
U9  dht11  [DHT11]
U10  MPU-6050  [mpu6050]

### Ports
3.3V_VSENSOR, 5V_VCC, 6050_AD0, 6050_INT, 6050_SCL, 6050_SDA, 6050_XCL, 6050_XDA, GND, MEGA_SCL, MEGA_SDA, TH_DATA

### Nets
+5V: R44.2 R47.2 R50.2 U9.1(VCC) ; port 5V_VCC
GND: C25.1 C26.1 C27.2 C28.2 C29.2 C30.2 R51.1 U9.4(GND) U10.1(CLKIN) U10.11(FSYNC) U10.18(GND) ; port GND
Net10_1: C25.2 C28.1 R45.1 R46.2 R48.1 R49.2 U10.8(VLOGIC) U10.13(VDD) ; port 3.3V_VSENSOR
Net20_1: 20.1 R44.1 U9.2(DATA) ; port TH_DATA
Net21_1: 21.1 Q14.3(S) R46.1 U10.24(SDA) ; port 6050_SDA
Net22_1: 22.1 Q14.2(D) R47.1 ; port MEGA_SDA
Net23_1: 23.1 Q15.3(S) R49.1 U10.23(SCL) ; port 6050_SCL
Net24_1: 24.1 Q15.2(D) R50.1 ; port MEGA_SCL
NetC26_2: C26.2 U10.10(REGOUT)
NetC27_1: C27.1 U10.20(CPOUT)
NetC29_1: C29.1 Q14.1(G) R45.2
NetC30_1: C30.1 Q15.1(G) R48.2
NetP9_1: U10.12(INT) ; port 6050_INT
NetP9_2: R51.2 U10.9(AD0) ; port 6050_AD0
NetP9_3: U10.7(AUX_CL) ; port 6050_XCL
NetP9_4: U10.6(AUX_DA) ; port 6050_XDA

Not connected (* = marked no-connect by the designer): U9 3(NC); U10 2(NC) 3(NC) 4(NC) 5(NC) 14(NC) 15(NC) 16(NC) 17(NC) 19(RESV) 21(RESV) 22(CLKOUT)

### Notes on the sheet
- (near R44) dht11 温湿度传感器，用来检测舱室是否漏水
- 六轴陀螺仪和加速度传感器，用来检测运行时的姿态倾角。

### Library data of the parts
C25-C30 = Cap: Capacitor; Published: 8-Jun-2000; LatestRevisionDate: 17-Jul-2002; LatestRevisionNote: Re-released for DXP Platform.; PackageReference: RAD-0.3; Publisher: Altium Limited; PackageDescription: Radial Cap, Thru-Hole; 2 Leads; 0.3 in Pin Spacing
Q14 Q15 = NMOS-2: as Q2 on sheet deepshark_sch; Published: 8-Jun-2000; LatestRevisionDate: 17-Jul-2002; LatestRevisionNote: Re-released for DXP Platform.; DatasheetVersion: PD-9.814; PackageVersion: Feb-1997; PackageReference: TO-220AB; Publisher: Altium Limited; PackageDescription: TO, Thru-Hole, Vertical, Heatsink Mounted; 3 In-Line Leads; Pitch 2.54 mm; ComponentLink1Description: Manufacturer Link; ComponentLink1URL: http://www.irf.com/
R44 = Res2: Resistor; Published: 8-Jun-2000; LatestRevisionDate: 17-Jul-2002; LatestRevisionNote: Re-released for DXP Platform.; PackageReference: AXIAL-0.4; Publisher: Altium Limited; PackageDescription: Axial Device, Thru-Hole; 2 Leads; 0.4 in Pin Spacing
R45-R51 = Res1: Resistor; Published: 8-Jun-2000; LatestRevisionDate: 17-Jul-2002; LatestRevisionNote: Re-released for DXP Platform.; PackageReference: AXIAL-0.3; Publisher: Altium Limited; PackageDescription: Axial Device, Thru-Hole; 2 Leads; 0.3 in Pin Spacing
U9 = dht411

## Sheet deepshark_ecs.SchDoc
size A4
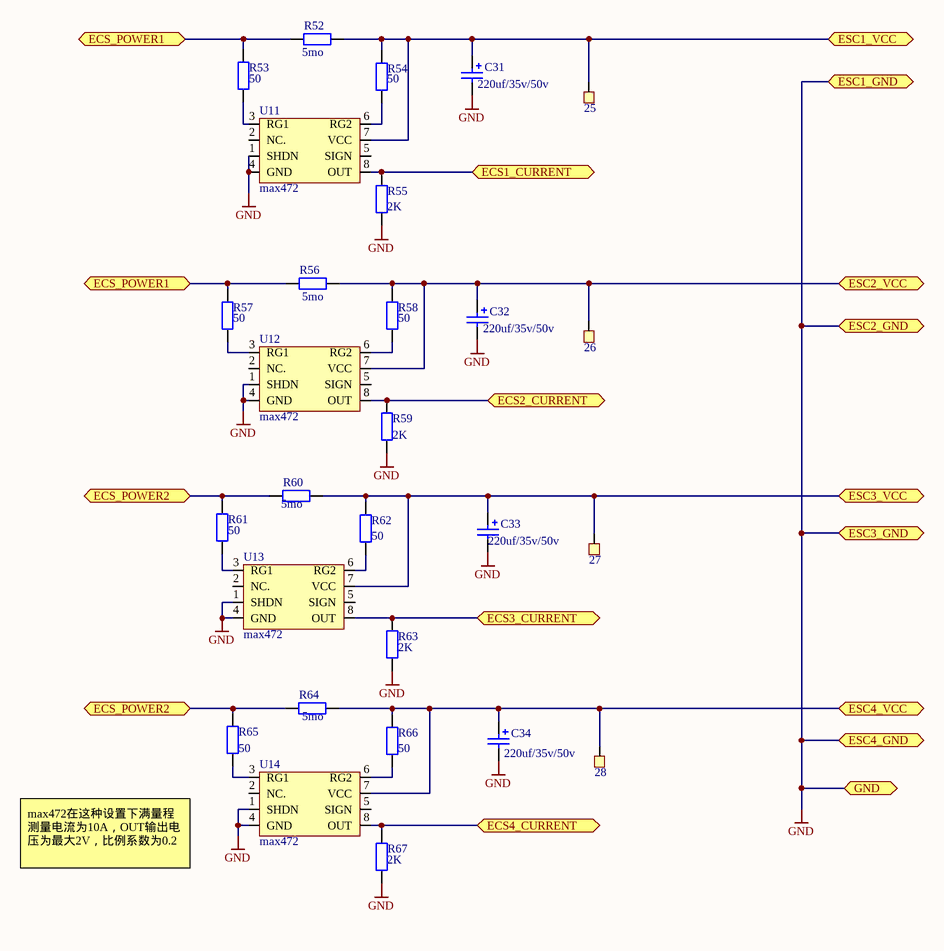
[diagram p6: deepshark_ecs.SchDoc]

### Parts
25  TP  [TestPoint]  (value not drawn)
26  TP  [TestPoint]  (value not drawn)
27  TP  [TestPoint]  (value not drawn)
28  TP  [TestPoint]  (value not drawn)
C31  value 220uf/35v/50v  [220uf-50v]  (hidden comment: Cap Pol2)
C32  value 220uf/35v/50v  [220uf-50v]  (hidden comment: Cap Pol2)
C33  value 220uf/35v/50v  [220uf-50v]  (hidden comment: Cap Pol2)
C34  value 220uf/35v/50v  [220uf-50v]  (hidden comment: Cap Pol2)
R52  value 5mo  [5mo]  (hidden comment: Res2)
R53  value 50  [my0603]  (hidden comment: Res2)
R54  value 50  [my0603]  (hidden comment: Res2)
R55  value 2K  [6-0805_M]  (hidden comment: Res2)
R56  value 5mo  [5mo]  (hidden comment: Res2)
R57  value 50  [my0603]  (hidden comment: Res2)
R58  value 50  [my0603]  (hidden comment: Res2)
R59  value 2K  [6-0805_M]  (hidden comment: Res2)
R60  value 5mo  [5mo]  (hidden comment: Res2)
R61  value 50  [my0603]  (hidden comment: Res2)
R62  value 50  [my0603]  (hidden comment: Res2)
R63  value 2K  [6-0805_M]  (hidden comment: Res2)
R64  value 5mo  [5mo]  (hidden comment: Res2)
R65  value 50  [my0603]  (hidden comment: Res2)
R66  value 50  [my0603]  (hidden comment: Res2)
R67  value 2K  [6-0805_M]  (hidden comment: Res2)
U11  max472  [SO-8_M]
U12  max472  [SO-8_M]
U13  max472  [SO-8_M]
U14  max472  [SO-8_M]

### Ports
ECS1_CURRENT, ECS2_CURRENT, ECS3_CURRENT, ECS4_CURRENT, ECS_POWER1, ECS_POWER2, ESC1_GND, ESC1_VCC, ESC2_GND, ESC2_VCC, ESC3_GND, ESC3_VCC, ESC4_GND, ESC4_VCC, GND

### Nets
GND: C31.2 C32.2 C33.2 C34.2 R55.1 R59.1 R63.1 R67.1 U11.1(SHDN) U11.4(GND) U12.1(SHDN) U12.4(GND) U13.1(SHDN) U13.4(GND) U14.1(SHDN) U14.4(GND) ; port ESC1_GND, port ESC2_GND, port ESC3_GND, port ESC4_GND, port GND
Net25_1: 25.1 C31.1 R52.2 R54.2 U11.7(VCC) ; port ESC1_VCC
Net26_1: 26.1 C32.1 R56.2 R58.2 U12.7(VCC) ; port ESC2_VCC
Net27_1: 27.1 C33.1 R60.2 R62.2 U13.7(VCC) ; port ESC3_VCC
Net28_1: 28.1 C34.1 R64.2 R66.2 U14.7(VCC) ; port ESC4_VCC
NetQ6_2: R52.1 R53.2 R56.1 R57.2 ; port ECS_POWER1
NetQ8_2: R60.1 R61.2 R64.1 R65.2 ; port ECS_POWER2
NetR53_1: R53.1 U11.3(RG1)
NetR54_1: R54.1 U11.6(RG2)
NetR55_2: R55.2 U11.8(OUT) ; port ECS1_CURRENT
NetR57_1: R57.1 U12.3(RG1)
NetR58_1: R58.1 U12.6(RG2)
NetR59_2: R59.2 U12.8(OUT) ; port ECS2_CURRENT
NetR61_1: R61.1 U13.3(RG1)
NetR62_1: R62.1 U13.6(RG2)
NetR63_2: R63.2 U13.8(OUT) ; port ECS3_CURRENT
NetR65_1: R65.1 U14.3(RG1)
NetR66_1: R66.1 U14.6(RG2)
NetR67_2: R67.2 U14.8(OUT) ; port ECS4_CURRENT

Not connected (* = marked no-connect by the designer): U11 2(NC.) 5(SIGN); U12 2(NC.) 5(SIGN); U13 2(NC.) 5(SIGN); U14 2(NC.) 5(SIGN)

### Notes on the sheet
- max472在这种设置下满量程测量电流为10A，OUT输出电压为最大2V，比例系数为0.2

### Library data of the parts
C31-C34 = Cap Pol2: Polarized Capacitor (Axial); Published: 8-Jun-2000; LatestRevisionDate: 17-Jul-2002; LatestRevisionNote: Re-released for DXP Platform.; PackageReference: POLAR0.8; Publisher: Altium Limited; PackageDescription: Polarized Capacitor; 2 Leads
R52-R67 = Res2: Resistor; Published: 8-Jun-2000; LatestRevisionDate: 17-Jul-2002; LatestRevisionNote: Re-released for DXP Platform.; PackageReference: AXIAL-0.4; Publisher: Altium Limited; PackageDescription: Axial Device, Thru-Hole; 2 Leads; 0.4 in Pin Spacing

## Sheet deepshark_servo.SchDoc
size A4
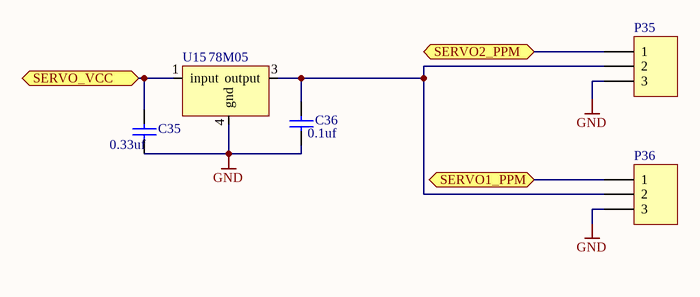
[diagram p7: deepshark_servo.SchDoc]

### Parts
C35  value 0.33uf  [C1206]  (hidden comment: Cap Semi)
C36  value 0.1uf  [6-0805_M]  (hidden comment: Cap Semi)
P35  Header 3  [HDR1X3]  (value not drawn)
P36  Header 3  [HDR1X3]  (value not drawn)
U15  78M05  [TO-252AA]

### Ports
SERVO1_PPM, SERVO2_PPM, SERVO_VCC

### Nets
GND: C35.1 C36.1 P35.3 P36.3 U15.4(gnd)
NetC20_1: C35.2 U15.1(input) ; port SERVO_VCC
NetC36_2: C36.2 P35.2 P36.2 U15.3(output)
NetP35_1: P35.1 ; port SERVO2_PPM
NetP36_1: P36.1 ; port SERVO1_PPM

### Library data of the parts
C35 C36 = Cap Semi: Capacitor (Semiconductor SIM Model); Published: 8-Jun-2000; LatestRevisionDate: 29-May-2009; LatestRevisionNote: IPC-7351 Footprint Added.; PackageReference: C1206; Publisher: Altium Limited; PackageDescription: Chip Capacitor
P35 P36 = Header 3: Header, 3-Pin; LatestRevisionDate: 17-Jul-2002; LatestRevisionNote: Re-released for DXP Platform.; Publisher: Altium Limited

## Nets that join several sheets
+5V: deepshark_sch (14 pins), deepshark_connector (8 pins), deepshark_power_sch (8 pins), deepshark_sensor (R44.2 R47.2 R50.2 U9.1)
BAT1: deepshark_connector (P25.2), deepshark_power_switch (11.1 C18.1 D7.1)
BAT2: deepshark_connector (P26.2), deepshark_power_switch (12.1 C19.1 D8.1)
GND: deepshark_sch (18 pins), deepshark_connector (28 pins), deepshark_power_sch (14 pins), deepshark_power_switch (18 pins), deepshark_pwm_power (8 pins), deepshark_sensor (11 pins), deepshark_ecs (16 pins), deepshark_servo (5 pins)
Net2_1: deepshark_sch (2.1 Q2.3 R4.2), deepshark_connector (PI3.8)
Net4_1: deepshark_sch (4.1 Q3.3 R7.1), deepshark_connector (PI3.10)
Net9_1: deepshark_sch (R3.2 R4.1 R6.1 R7.2), deepshark_connector (D4.1 P3.1 P3.2), deepshark_power_sch (9.1 C15.1 U3.2)
Net10_1: deepshark_connector (P10.4 P11.4), deepshark_power_sch (10.1 C17.1 U4.2), deepshark_sensor (8 pins)
Net13_1: deepshark_connector (P7.2), deepshark_power_switch (5 pins)
Net14_1: deepshark_connector (P8.2), deepshark_power_switch (5 pins)
Net15_1: deepshark_sch (U1.93), deepshark_power_switch (15.1 C24.2 R30.1 R31.2)
Net16_1: deepshark_connector (P27.1), deepshark_pwm_power (16.1 D11.1 Q10.2)
Net17_1: deepshark_connector (P29.1), deepshark_pwm_power (17.1 D12.1 Q11.2)
Net18_1: deepshark_connector (P28.1), deepshark_pwm_power (18.1 D13.1 Q12.2)
Net19_1: deepshark_connector (P30.1), deepshark_pwm_power (19.1 D14.1 Q13.2)
Net20_1: deepshark_sch (U1.60), deepshark_sensor (20.1 R44.1 U9.2)
Net21_1: deepshark_connector (P10.2 P11.2), deepshark_sensor (21.1 Q14.3 R46.1 U10.24)
Net22_1: deepshark_sch (U1.44), deepshark_sensor (22.1 Q14.2 R47.1)
Net23_1: deepshark_connector (P10.1 P11.1), deepshark_sensor (23.1 Q15.3 R49.1 U10.23)
Net24_1: deepshark_sch (U1.43), deepshark_sensor (24.1 Q15.2 R50.1)
Net25_1: deepshark_connector (P20.2), deepshark_ecs (5 pins)
Net26_1: deepshark_connector (P21.2), deepshark_ecs (5 pins)
Net27_1: deepshark_connector (P22.2), deepshark_ecs (5 pins)
Net28_1: deepshark_connector (P23.2), deepshark_ecs (5 pins)
NetC20_1: deepshark_connector (P27.2 P28.2 P29.2 P30.2), deepshark_power_switch (17 pins), deepshark_pwm_power (D11.2 D12.2 D13.2 D14.2), deepshark_servo (C35.2 U15.1)
Netext_1: deepshark_sch (U1.89), deepshark_connector (ext.1)
Netext_2: deepshark_sch (U1.78), deepshark_connector (ext.2)
Netext_3: deepshark_sch (U1.88), deepshark_connector (ext.3)
Netext_4: deepshark_sch (U1.77), deepshark_connector (ext.4)
Netext_5: deepshark_sch (U1.87), deepshark_connector (ext.5)
Netext_6: deepshark_sch (U1.76), deepshark_connector (ext.6)
Netext_7: deepshark_sch (U1.86), deepshark_connector (ext.7)
Netext_8: deepshark_sch (U1.75), deepshark_connector (ext.8)
NetP9_1: deepshark_connector (P9.1), deepshark_sensor (U10.12)
NetP9_2: deepshark_connector (P9.2), deepshark_sensor (R51.2 U10.9)
NetP9_3: deepshark_connector (P9.3), deepshark_sensor (U10.7)
NetP9_4: deepshark_connector (P9.4), deepshark_sensor (U10.6)
NetP14_2: deepshark_connector (P14.2), deepshark_power_switch (R28.2 U8.4)
NetP16_3: deepshark_sch (U1.15), deepshark_connector (P16.3)
NetP17_3: deepshark_sch (U1.16), deepshark_connector (P17.3)
NetP18_3: deepshark_sch (U1.17), deepshark_connector (P18.3)
NetP19_3: deepshark_sch (U1.18), deepshark_connector (P19.3)
NetP35_1: deepshark_sch (U1.24), deepshark_servo (P35.1)
NetP36_1: deepshark_sch (U1.23), deepshark_servo (P36.1)
NetPI3_22: deepshark_sch (Q1.2), deepshark_connector (PI3.22)
NetQ6_2: deepshark_power_switch (Q6.2), deepshark_ecs (R52.1 R53.2 R56.1 R57.2)
NetQ8_2: deepshark_power_switch (Q8.2), deepshark_ecs (R60.1 R61.2 R64.1 R65.2)
NetR18_2: deepshark_sch (U1.91), deepshark_power_switch (R18.2 U5.8)
NetR22_2: deepshark_sch (U1.92), deepshark_power_switch (R22.2 U6.8)
NetR24_1: deepshark_sch (U1.36), deepshark_power_switch (R24.1)
NetR26_2: deepshark_sch (U1.37), deepshark_power_switch (R26.2)
NetR32_1: deepshark_power_sch (S2.2), deepshark_power_switch (R32.1 R34.2 U7.7)
NetR35_1: deepshark_sch (U1.90), deepshark_power_switch (R35.1 U7.8)
NetR36_1: deepshark_sch (U1.5), deepshark_pwm_power (R36.1)
NetR38_1: deepshark_sch (U1.6), deepshark_pwm_power (R38.1)
NetR40_1: deepshark_sch (U1.7), deepshark_pwm_power (R40.1)
NetR42_1: deepshark_sch (U1.1), deepshark_pwm_power (R42.1)
NetR55_2: deepshark_sch (U1.97), deepshark_ecs (R55.2 U11.8)
NetR59_2: deepshark_sch (U1.96), deepshark_ecs (R59.2 U12.8)
NetR63_2: deepshark_sch (U1.95), deepshark_ecs (R63.2 U13.8)
NetR67_2: deepshark_sch (U1.94), deepshark_ecs (R67.2 U14.8)
NetRX2_1: deepshark_sch (U1.13), deepshark_connector (RX2.1)
NetRX2_2: deepshark_sch (U1.12), deepshark_connector (RX2.2)
R_ONOFF: deepshark_sch (U1.35), deepshark_power_sch (U2.5)
T_A: deepshark_connector (P2.2 P4.1 P4.2), deepshark_power_switch (C23.2 U8.2)
T_B: deepshark_connector (P2.1 P4.5 P4.6), deepshark_power_switch (C23.1 R29.2)